# Altium schematic sheet SCH_BMS.SchDoc
size A4
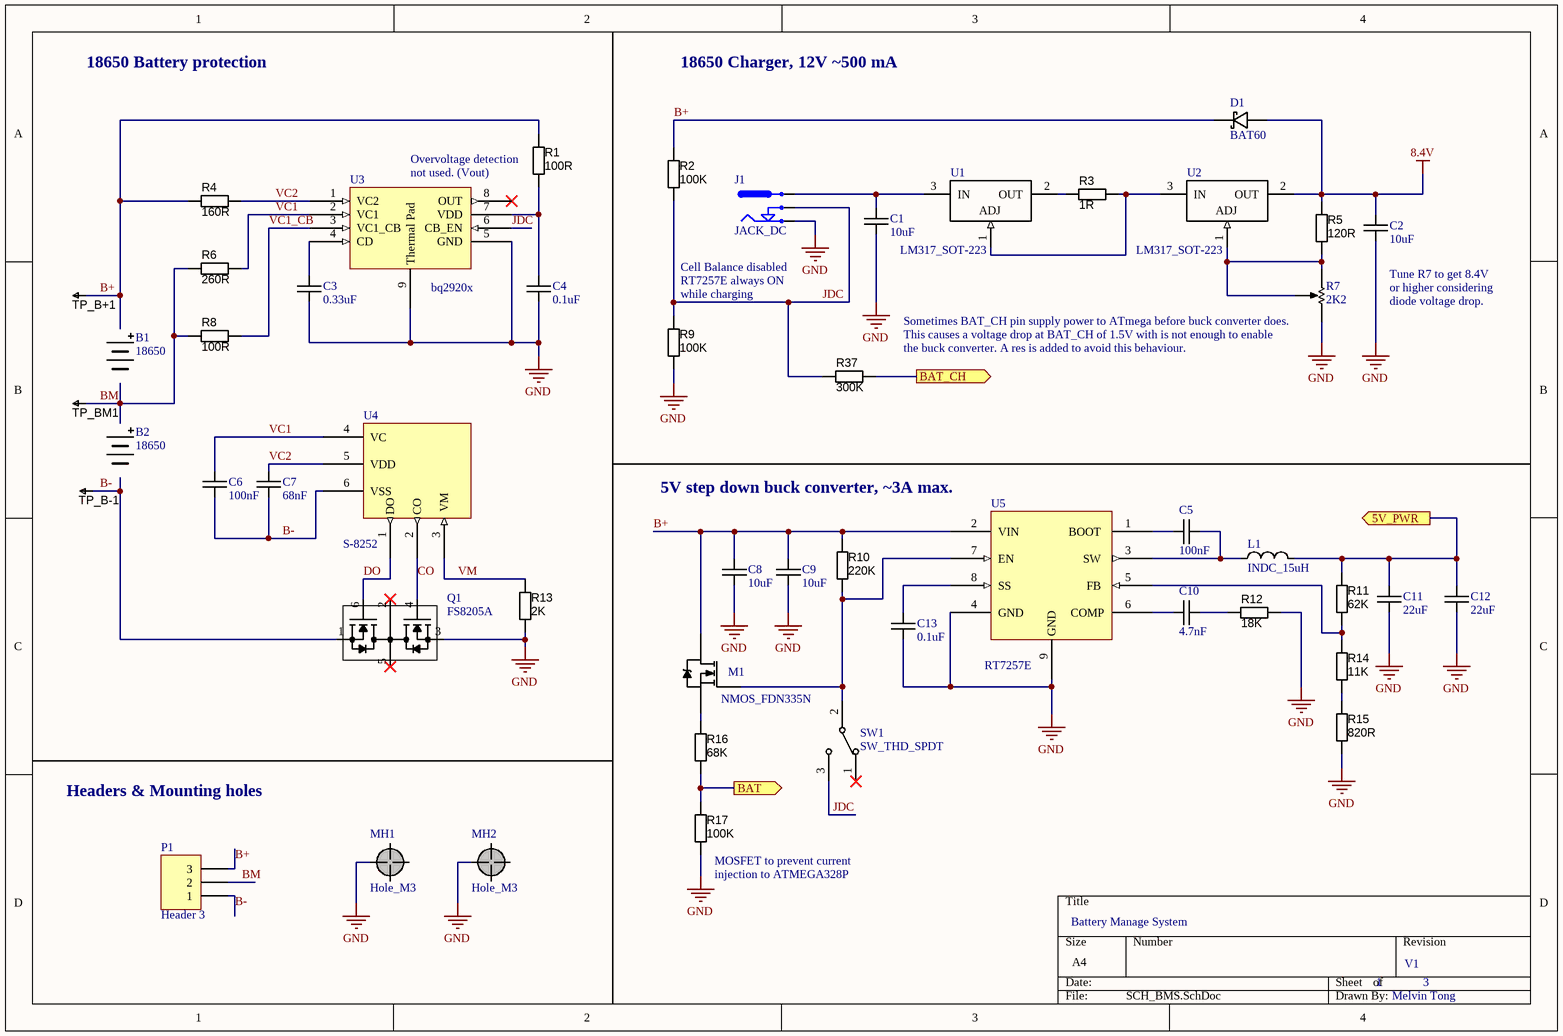
[diagram p0: SCH_BMS.SchDoc]

## Parts
B1  18650
B2  18650
C1  10uF  [CAP_0805]
C2  10uF  [CAP_1206]
C3  0.33uF  [CAP_0805]
C4  0.1uF  [CAP_0805]
C5  100nF  [CAP_0805]
C6  100nF  [CAP_0805]
C7  68nF  [CAP_0805]
C8  10uF  [CAP_1206]
C9  10uF  [CAP_1206]
C10  4.7nF  [CAP_0805]
C11  22uF  [CAP_1206]
C12  22uF  [CAP_1206]
C13  0.1uF  [CAP_0805]
D1  BAT60  [SOD323]
J1  JACK_DC  [DC-004]
L1  INDC_15uH  [IND_15uH]
M1  NMOS_FDN335N  [SOT23_213]
MH1  Hole_M3  [Hole_M3]
MH2  Hole_M3  [Hole_M3]
P1  Header 3  [HDR1X3]
Q1  FS8205A  [SOT23-6]
R1  100R  [RESC3216X70N]
R2  100K  [RESC3216X70N]
R3  value 1R  [RESC6332X70N]  (hidden comment: RES_1R_2512)
R4  160R  [RESC3216X70N]
R5  120R  [RESC3216X70N]
R6  260R  [RESC3216X70N]
R7  2K2  [RES_VAR]
R8  100R  [RESC3216X70N]
R9  100K  [RESC3216X70N]
R10  220K  [RESC3216X70N]
R11  62K  [RESC3216X70N]
R12  18K  [RESC3216X70N]
R13  2K  [RESC3216X70N]
R14  11K  [RESC3216X70N]
R15  820R  [RESC3216X70N]
R16  68K  [RESC3216X70N]
R17  100K  [RESC3216X70N]
R37  300K  [RESC3216X70N]
SW1  SW_THD_SPDT  [3P_header]
TP_B+1  TESTPOINT  [TP-R20]  (value not drawn)  (no BOM)
TP_B-1  TESTPOINT  [TP-R20]  (value not drawn)  (no BOM)
TP_BM1  TESTPOINT  [TP-R20]  (value not drawn)  (no BOM)
U1  LM317_SOT-223  [SOT223]
U2  LM317_SOT-223  [SOT223]
U3  bq2920x  [bq2920x]
U4  S-8252  [SOT23-6]
U5  RT7257E  [RT7257E]

## Ports
5V_PWR (out), BAT (out), BAT_CH (out)

## Nets
8.4V: C2.1 D1.A R5.1 U2.2(OUT)
GND: C1.2 C2.2 C3.2 C4.2 C8.2 C9.2 C11.2 C12.2 C13.2 J1.1 MH1.MH MH2.MH Q1.3(D2) R7.3(CW) R9.1 R12.2 R13.2 R15.2 R17.2 U3.5(GND) U3.9(Thermal_Pad) U5.4(GND) U5.9(GND)
5V_PWR: C11.1 C12.1 L1.2 R11.1 ; port 5V_PWR
B+: C8.1 C9.1 D1.K M1.3(D) P1.3 R1.2 R2.2 R4.1 R10.1 TP_B+1.1 U5.2(VIN)
B-: C6.2 C7.2 P1.1 Q1.1(S1) TP_B-1.1 U4.6(VSS)
BAT: R16.2 R17.1 ; port BAT
BAT_CH: R37.2 ; port BAT_CH
BM: P1.2 R6.1 R8.1 TP_BM1.1
CO: Q1.4(G2) U4.2(CO)
DO: Q1.6(G1) U4.1(DO)
JDC: J1.3 R2.1 R9.2 R37.1 SW1.3 U3.6(CB_EN)
VC1: C6.1 R6.2 U3.2(VC1) U4.4(VC)
VC1_CB: R8.2 U3.3(VC1_CB)
VC2: C7.1 R4.2 U3.1(VC2) U4.5(VDD)
VM: R13.1 U4.3(VM)
NetC1_1: C1.1 J1.2 U1.3(IN)
NetC3_1: C3.1 U3.4(CD)
NetC4_1: C4.1 R1.1 U3.7(VDD)
NetC5_1: C5.1 U5.1(BOOT)
NetC5_2: C5.2 L1.1 U5.3(SW)
NetC10_1: C10.1 U5.6(COMP)
NetC10_2: C10.2 R12.1
NetC13_1: C13.1 U5.8(SS)
NetM1_1: M1.1(G) R10.2 SW1.2 U5.7(EN)
NetM1_2: M1.2(S) R16.1
NetR3_1: R3.1 U1.2(OUT)
NetR3_2: R3.2 U1.1(ADJ) U2.3(IN)
NetR5_2: R5.2 R7.1(CCW) R7.2(WIPER) U2.1(ADJ)
NetR11_2: R11.2 R14.1 U5.5(FB)
NetR14_2: R14.2 R15.1

Not connected (* = marked no-connect by the designer): Q1 2(D1)* 5(D2)*; SW1 1*; U3 8(OUT)*

## Notes on the sheet
- 18650 Battery protection
- 18650 Charger, 12V ~500 mA
- (near R1) Overvoltage detection
- not used. (Vout)
- Cell Balance disabled
- (near R9) while charging
- RT7257E always ON
- (near C2) Tune R7 to get 8.4V
- or higher considering
- diode voltage drop.
- (near R7) This causes a voltage drop at BAT_CH of 1.5V with is not enough to enable
- (near R7) Sometimes BAT_CH pin supply power to ATmega before buck converter does.
- the buck converter. A res is added to avoid this behaviour.
- 5V step down buck converter, ~3A max.
- Headers & Mounting holes
- (near R17) MOSFET to prevent current
- (near R17) injection to ATMEGA328P
- Battery Manage System
- 1
- V1
- 3
- Melvin Tong

## Library data of the parts
B1 B2 = Battery_18650
C1 C2 C8 C9 = CAP_10uF: SMD 0805/1206
C3 = CAP_330nF: SMD 0805
C4 C6 C7 C13 = CAP_0.1uF: SMD 0805
C5 = CAP_100nF: SMD 0805
C10 = CAP_4.7nF: SMD 0805
C11 C12 = CAP_22uF: SMD 1206
D1 = BAT60: Schottky Diode 3A, Vf~0.24V, Vr=10V
L1 = INDC_15uH: 15uH ±20% 4.2A 28.4mΩ SMD,12.5x12.5x6.5mm Power Inductors
P1 = Header 3: Header, 3-Pin; LatestRevisionDate: 17-Jul-2002; LatestRevisionNote: Re-released for DXP Platform.; Publisher: Altium Limited
Q1 = FS8205A: NMOS, Drain-Connected, Imax 6A
R1 R8 = RES_100R: Resistor SMD, 1206; Value: N/A
R2 R9 R17 = RES_100K: Resistor SMD, 1206; Value: N/A
R3 = RES_1R_2512: Resistor SMD 1Ω ±5% 2W ±400ppm/℃ 2512; Ratings: 1W; SCDType: spec; Tolerance: ±5%; Material: Thick Film; Package / Case: 2512 (6332 metric)
R4 = RES_160R: Resistor SMD, 1206; Value: N/A
R5 = RES_120R: Resistor SMD, 1206; Value: N/A
R6 = RES_260R: Resistor SMD, 1206; Value: N/A
R7 = RES_Var_2K2: Resistor SMD Variable
R10 = RES_220K: Resistor SMD, 1206; Value: N/A
R11 = RES_62K: Resistor SMD, 1206; Value: N/A
R12 = RES_18K: Resistor SMD, 1206; Value: N/A
R13 = RES_2K: Resistor SMD, 1206; Value: N/A
R14 = RES_11K: Resistor SMD, 1206; Value: N/A
R15 = RES_820R: Resistor SMD, 1206; Value: N/A
R16 = RES_68K: Resistor SMD, 1206; Value: N/A
R37 = RES_300K: Resistor SMD, 1206; Value: N/A
SW1 = SW_THD_SPDT: Switch 2 position
TP_B+1 TP_B-1 TP_BM1 = TESTPOINT: SMD test pin
U1 U2 = LM317_SOT-223: Linear Voltage Regulator
U3 = bq2920x: Automatic Cell Balance 2S Li-Ion Battery
U4 = S-8252: Battery protection IC for 2S battery pack
U5 = RT7257E: DC/DC Buck Converter, 3A, 4.5V-17V Vin